# Altium schematic sheet Power Distribution.SchDoc
size A; Organization: Underwater Robotics; Address1: c/o Student Involvement; Address2: Campus Box 7306; Address3: 2016 Cates Ave. Raleigh, NC 27695; Revision: A1; SheetNumber: 2C; SheetTotal: 2C
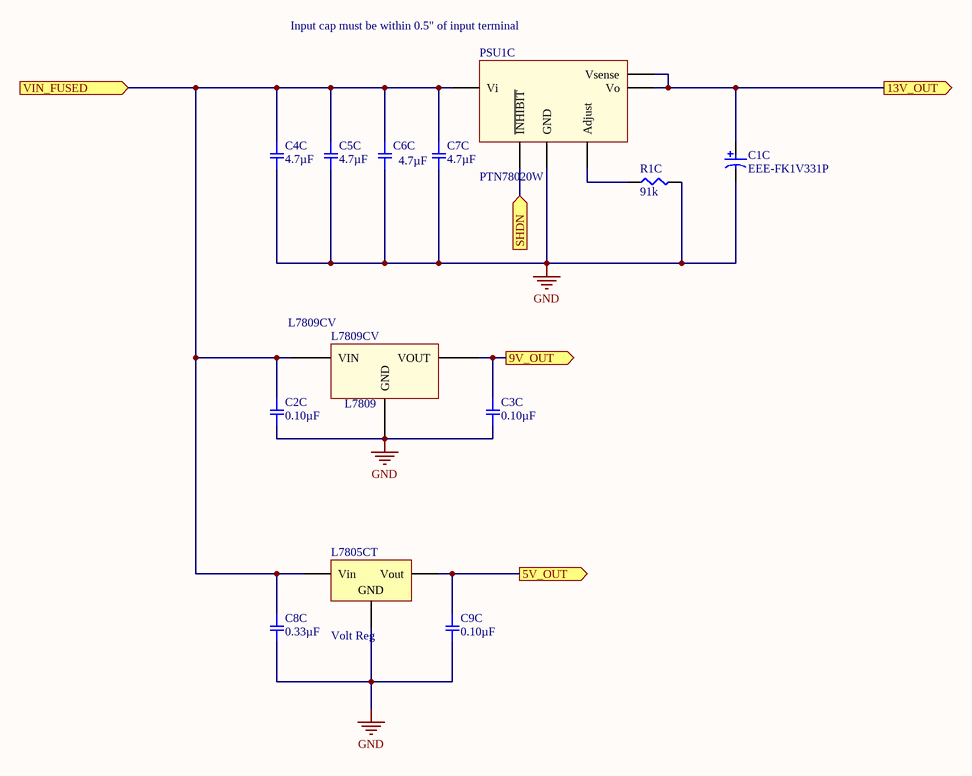
[diagram p0: Power Distribution.SchDoc]

## Parts
C1C  EEE-FK1V331P  [PNSC-EEE-FK1V331P_L]
C2C  0.10µF  [SMD-1206C]
C3C  0.10µF  [SMD-1206C]
C4C  4.7µF  [SMD-1206C]
C5C  4.7µF  [SMD-1206C]
C6C  4.7µF  [SMD-1206C]
C7C  4.7µF  [SMD-1206C]
C8C  0.33µF  [SMD-1206C]
C9C  0.10µF  [SMD-1206C]
L7805CT  Volt Reg  [D2PAK_N]
L7809CV  L7809  Manufacturer Part Number: L7809CV  [L7809CD2T-D2PAK]
PSU1C  PTN78020W  [PTN78020]
R1C  91k  [SMD-1206-RES]

## Ports
5V_OUT (out), 9V_OUT (out), 13V_OUT (out), SHDN (in), VIN_FUSED (in)

## Nets
GND: C1C.2 C2C.2 C3C.2 C4C.2 C5C.2 C6C.2 C7C.2 C8C.2 C9C.2 L7805CT.2(GND) L7809CV.GND PSU1C.GND R1C.2
5V_OUT: C9C.1 L7805CT.3(Vout) ; port 5V_OUT
9V_OUT: C3C.1 L7809CV.OUTPUT(VOUT) ; port 9V_OUT
13V_OUT: C1C.1 PSU1C.vo(Vo) PSU1C.Vsense ; port 13V_OUT
SHDN: PSU1C.INHIBIT(~{INHIBIT}) ; port SHDN
VIN_FUSED: C2C.1 C4C.1 C5C.1 C6C.1 C7C.1 C8C.1 L7805CT.1(Vin) L7809CV.INPUT(VIN) PSU1C.VIN(Vi) ; port VIN_FUSED
NetPSU1C_Rset: PSU1C.Rset(Adjust) R1C.1

## Notes on the sheet
- (near PSU1C) Input cap must be within 0.5" of input terminal
- Title
- Size:
- Date:
- A
- Number:
- Time:
- Revision:
- Sheet
- of
- File:

## Library data of the parts
C1C = CMP-2000-06212-1: Aluminum Electrolytic Capacitor, 330 uF, 35 V, -55 to 105 degC, 2-Pin CAPAE, RoHS, Tape and Reel; Manufacturer: Panasonic; Capacitance: 330µF; Type: Can; Impedance: 0.08O; Ripple Current: 850mA; Lifetime@Temperature: 2000Hrs@105°C; Rated Voltage: 35V; Datasheet Version: 07/2008; Manufacturer URL: http://www.panasonic.com/; Package Description: 2-Pin Capacitor Aluminum Electrolytic, Body 10.3 x 10.3 mm, Height 10.5 mm; Case Size/Dimension: Ø10x10.2mm; Datasheet URL: https://datasheet.ciiva.com/29313/443481-da-01-en-smd-elko-vfk-g-330-uf-35v-29313592.pdf; Series: FK; Mounting Technology: SurfaceMount; Package Reference: EEE-FK1V331P; Operating Temp-Max: 105°C; Operating Temp Range: -55to+105°C
C2C C3C = GCJ31CR72E104KXJ3L: CAP CER 0.1UF 250V X7R 1206; Manufacturer: Murata Electronics North America; Factory Stock: 0; Unit Price (USD): 0.36; Minimum Quantity: 1; Tolerance: ±10%; Datasheets: http://www.murata.com/~/media/webrenewal/support/library/catalog/products/capacitor/mlcc/c03e.ashx; Image: //media.digikey.com/Renders/Murata%20Renders/GR331BD72E473KW01L.jpg; Digi-Key Part Number: 490-12647-1-ND; Part Number: GCJ31CR72E104KXJ3L; Quantity Available: 3645; @ qty: 0; Packaging: Cut Tape (CT); Series: GCJ; Part Status: Active; Value: 0.10µF; Voltage: 250V; Temperature Coefficient: X7R; Operating Temperature: -55°C ~ 125°C; Features: Soft Termination; Ratings: AEC-Q200; Applications: Automotive, Boardflex Sensitive; Mounting Type: Surface Mount, MLCC; Package / Case: 1206 (3216 Metric); Size / Dimension: 0.126" L x 0.063" W (3.20mm x 1.60mm); Height - Seated (Max): -; Thickness (Max): 0.071" (1.80mm); Lead Spacing: -; Lead Style: -
C4C C5C C6C C7C = GCM31CC71H475KA03L: CAP CER 4.7UF 50V X7S 1206; Manufacturer: Murata Electronics North America; Factory Stock: 0; Unit Price (USD): 0.57; Minimum Quantity: 1; Tolerance: ±10%; Datasheets: http://www.murata.com/~/media/webrenewal/support/library/catalog/products/capacitor/mlcc/c03e.ashx; Image: //media.digikey.com/Renders/Murata%20Renders/GR331BD72E473KW01L.jpg; Digi-Key Part Number: 490-11167-1-ND; Part Number: GCM31CC71H475KA03L; Quantity Available: 11700; @ qty: 0; Packaging: Cut Tape (CT); Series: GCM; Part Status: Active; Value: 4.7µF; Voltage: 50V; Temperature Coefficient: X7S; Operating Temperature: -55°C ~ 125°C; Features: -; Ratings: AEC-Q200; Applications: Automotive; Mounting Type: Surface Mount, MLCC; Package / Case: 1206 (3216 Metric); Size / Dimension: 0.126" L x 0.063" W (3.20mm x 1.60mm); Height - Seated (Max): -; Thickness (Max): 0.071" (1.80mm); Lead Spacing: -; Lead Style: -
C8C = GCM31MR71H334KA37L: CAP CER 0.33UF 50V X7R 1206; Manufacturer: Murata Electronics North America; Factory Stock: 0; Unit Price (USD): 0.53; Minimum Quantity: 1; Tolerance: ±10%; Datasheets: http://www.murata.com/~/media/webrenewal/support/library/catalog/products/capacitor/mlcc/c03e.ashx; Image: //media.digikey.com/Renders/Murata%20Renders/GR331BD72E473KW01L.jpg; Digi-Key Part Number: 490-8060-1-ND; Part Number: GCM31MR71H334KA37L; Quantity Available: 5573; @ qty: 0; Packaging: Cut Tape (CT); Series: GCM; Part Status: Active; Value: 0.33µF; Voltage: 50V; Temperature Coefficient: X7R; Operating Temperature: -55°C ~ 125°C; Features: -; Ratings: AEC-Q200; Applications: Automotive; Mounting Type: Surface Mount, MLCC; Package / Case: 1206 (3216 Metric); Size / Dimension: 0.126" L x 0.063" W (3.20mm x 1.60mm); Height - Seated (Max): -; Thickness (Max): 0.049" (1.25mm); Lead Spacing: -; Lead Style: -
C9C = GRJ319R71H104KE11L: CAP CER 0.1UF 50V X7R 1206; Manufacturer: Murata Electronics North America; Factory Stock: 0; Unit Price (USD): 0.26; Minimum Quantity: 1; Tolerance: ±10%; Datasheets: http://www.murata.com/~/media/webrenewal/support/library/catalog/products/capacitor/mlcc/c02e.pdf; Image: //media.digikey.com/Renders/Murata%20Renders/GR331BD72E473KW01L.jpg; Digi-Key Part Number: 490-10930-1-ND; Part Number: GRJ319R71H104KE11L; Quantity Available: 4445; @ qty: 0; Packaging: Cut Tape (CT); Series: GRJ; Part Status: Active; Value: 0.10µF; Voltage: 50V; Temperature Coefficient: X7R; Operating Temperature: -55°C ~ 125°C; Features: Soft Termination; Ratings: -; Applications: Boardflex Sensitive; Mounting Type: Surface Mount, MLCC; Package / Case: 1206 (3216 Metric); Size / Dimension: 0.126" L x 0.063" W (3.20mm x 1.60mm); Height - Seated (Max): -; Thickness (Max): 0.037" (0.95mm); Lead Spacing: -; Lead Style: -
L7805CT = Volt Reg: Voltage Regulator; Published: 24-Mar-1999; LatestRevisionDate: 29-May-2009; LatestRevisionNote: IPC-7351 Footprint Added.; PackageReference: D2PAK; Publisher: Altium Limited; PackageDescription: 3-Pin Transistor Outline Package 2.54 mm Pitch, 15.1 mm Lead Span
L7809CV = L7809: Manufacturer: STMICROELECTRONICS; Input Voltage Min: 15; Input Voltage Max: 35; Output Current: 1.5; Linear Regulator Case Style: TO-220; No. of Pins: 3; Supplier 1: Newark; Supplier Part Number 1: 89K1390; RoHS: YES; Stock 1: 16675; Pricing 1: 1=0.253, 10=0.253, 25=0.253, 100=0.253, 250=0.232, 500=0.232, 1000=0.214, 2500=0.214 (USD); Operating Temperature Min: 0 C; Operating Temperature Max: 125 C; MSL: -; ComponentLink1URL: http://www.farnell.com/datasheets/1805459.pdf; ComponentLink1Description: http://www.farnell.com/datasheets/1805459.pdf; ComponentLink2URL: http://www.st.com/stonline/products/literature/ds/2143/l7809c.pdf; ComponentLink2Description: http://www.st.com/stonline/products/literature/ds/2143/l7809c.pdf
PSU1C = PTN78020W: Adjustable, non-isolating DC-DC converter
R1C = ERJ-8GEYJ913V: RES SMD 91K OHM 5% 1/4W 1206; Manufacturer: Panasonic Electronic Components; Factory Stock: 0; Unit Price (USD): 0.00700; @ qty: 1500; Minimum Quantity: 1; Power (Watts): 0.25W, 1/4W; Temperature Coefficient: ±200ppm/°C; Part Number: ERJ-8GEYJ913V; Datasheets: http://industrial.panasonic.com/www-cgi/jvcr13pz.cgi?E+PZ+3+AOA0001+ERJ8GEYJ913V+7+WW; Image: //media.digikey.com/Renders/Panasonic%20Renders/ERJ-1206%20Pkg.jpg; Digi-Key Part Number: P91KECT-ND; Quantity Available: 30132; Packaging: Cut Tape (CT); Series: ERJ; Part Status: Active; Value: 91k; Tolerance: ±5%; Composition: Thick Film; Features: Automotive AEC-Q200; Operating Temperature: -55°C ~ 155°C; Package / Case: 1206 (3216 Metric); Supplier Device Package: 1206; Size / Dimension: 0.126" L x 0.063" W (3.20mm x 1.60mm); Height - Seated (Max): 0.028" (0.70mm); Number of Terminations: 2; Failure Rate: -